# Altium project Jammer.PrjPcb
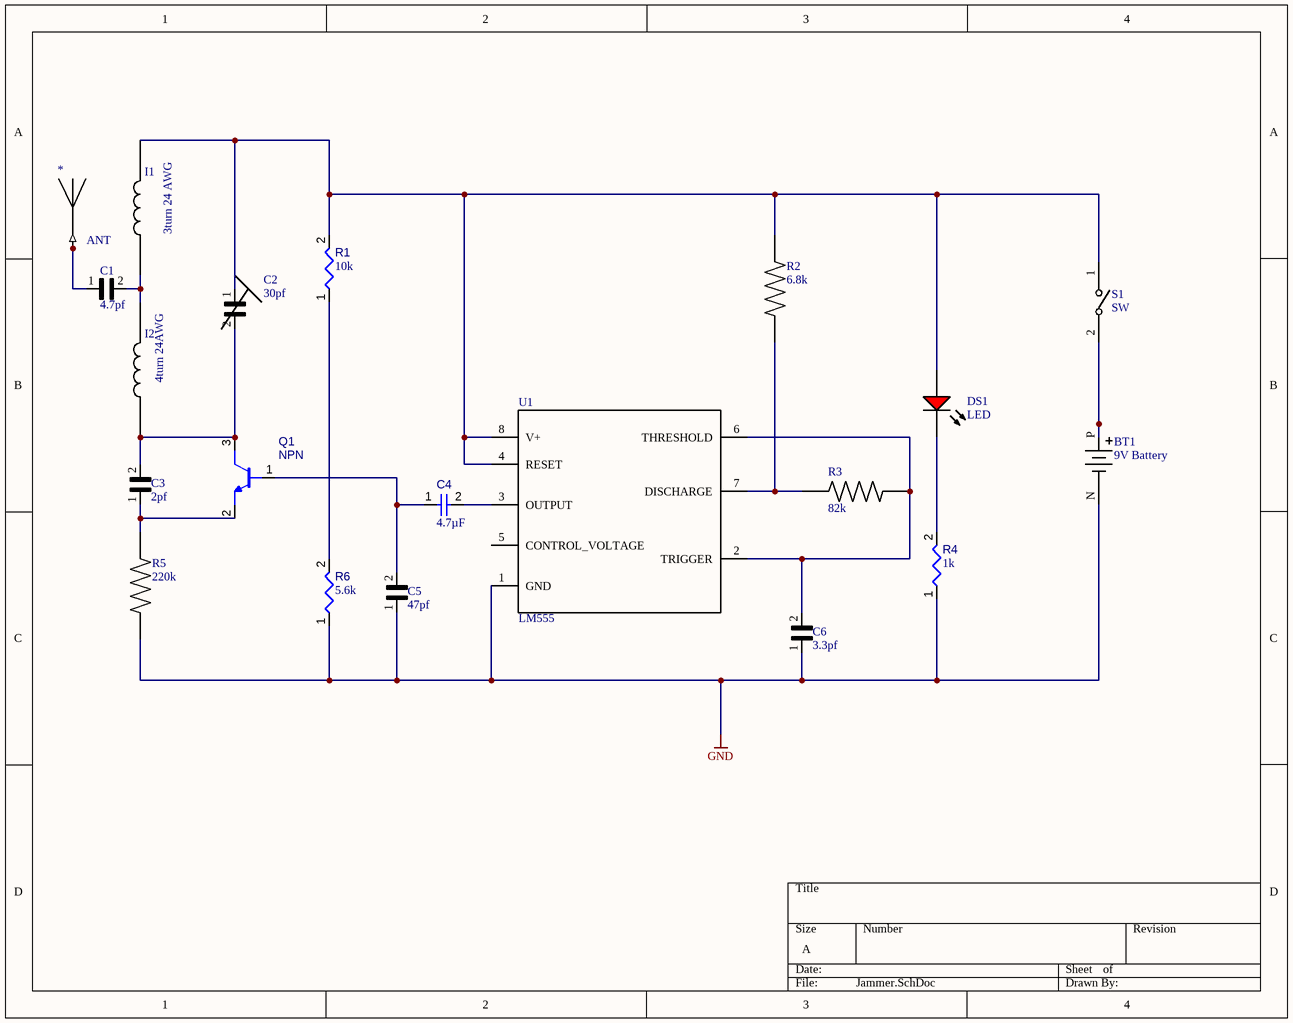
[diagram p0: Jammer.SchDoc]
1 sheet, 20 parts. Net scope: global (net labels, ports and power ports of the same name join across sheets).
Board file: Jammer.PcbDoc

## Sheet Jammer.SchDoc
size A; SheetNumber: 1; SheetTotal: 1

### Parts
*  ANT  [ANT]
BT1  9V Battery  [9V Battery]
C1  4.7pf  [4.7pf CAP]
C2  30pf  [30pf Trimmer]
C3  2pf  [2pf CAP]
C4  value 4.7µF  [CAPC0805(2012)145_L]  (hidden comment: Capacitor 4.7µF +/-40% 25V 0805)
C5  47pf  [47pf CAP]
C6  3.3pf  [3.3pf CAP]
DS1  LED  [AVAG-HSMX-C190_V]
I1  3turn 24 AWG  [Inductor]
I2  4turn 24AWG  [Inductor]
Q1  NPN  [ROHM-SOT723-3_V]
R1  value 10k  [RESC1608X55X25ML10T15]  (hidden comment: Resistor 10k +/-1% 0603 100 mW)
R2  6.8k  [6.8K RES]
R3  82k  [82K RES]
R4  value 1k  [RESC0805(2012)_L]  (hidden comment: Resistor 1K +/-5% 0805 125 mW)
R5  220k  [220 RES]
R6  value 5.6k  [RESC0402(1005)_L]  (hidden comment: 5D6KR2J)
S1  SW  [Switch]
U1  LM555  [LM555]

### Nets
GND: BT1.N(NEG) C5.1 C6.1 R4.1 R5.1 R6.1 U1.1(GND)
Net*_1: *.1(FEED) *.2(FEED) C1.1
NetBT1_P: BT1.P(POS) S1.2
NetC1_2: C1.2 I1.1 I2.2
NetC2_1: C2.1 DS1.1(A) I1.2 R1.2 R2.2 S1.1 U1.4(RESET) U1.8(V+)
NetC2_2: C2.2 C3.2 I2.1 Q1.3(C)
NetC3_1: C3.1 Q1.2(E) R5.2
NetC4_1: C4.1 C5.2 Q1.1(B)
NetC4_2: C4.2 U1.3(OUTPUT)
NetC6_2: C6.2 R3.2 U1.2(TRIGGER) U1.6(THRESHOLD)
NetDS1_2: DS1.2(K) R4.2
NetR1_1: R1.1 R6.2
NetR2_1: R2.1 R3.1 U1.7(DISCHARGE)

Not connected (* = marked no-connect by the designer): U1 5(CONTROL_VOLTAGE)

### Library data of the parts
C1 = 4.7pf CAP
C2 = 30pf Trimmer
C3 = 2pf CAP
C4 = CMP-001-00080-4: Chip Capacitor, 4.7µF +/-40%, 25V, 0805, Thickness 1.45 mm; Tolerance: 20%; Voltage Rating: 25V; Min Operating Temperature: -55°C; Max Operating Temperature: 85°C; Pins: 2; Mounting Technology: SMT; Case/Package: 0805
C5 = 47pf CAP
C6 = 3.3pf CAP
DS1 = CMP-007-00014-2: LED Uni-Color Red, 65 mW, 20 mA, -40 to 85 degC, 2-Pin SMD, RoHS, Tape and Reel; Manufacturer: Avago; Nominal Vf: 1.8V; Luminous Intensity: 17mcd; Power: 78mW; Forward Current: 20mA; Lens Style: Diffused; Viewing Angle: 170degrees; Package Quantity: 4000; Colour: Red; Manufacturer URL: http://www.avagotech.com/; Min Operating Temperature: -40°C; Datasheet URL: http://docs.avagotech.com/docs/AV02-0551EN; RoHS Compliant: True; Forward Voltage: 1.8V; Pins: 2; Max Operating Temperature: 85°C; Packaging: TapeandReel; Package Reference: HSMX-C190; Datasheet Version: Mar-12; Package Description: 2-Pin Surface Mount Device, Body 1.6 x 0.8 mm, Height 0.9 mm; Case/Package: 0603; Mounting Technology: SM; Illumination Colour: Red
I1 I2 = Inductor
Q1 = CMP-013-00028-2: NPN General Purpose Transistor, 3-Pin SOT-723, Pb-Free, Tape and Reel; ComponentLink3Description: Package Specification; ComponentLink1URL: http://www.onsemi.com/; ComponentLink3URL: http://www.onsemi.com/pub_link/Collateral/631AA.PDF; ComponentLink2Description: Datasheet; Mounting Technology: SMT; Pins: 3; Case/Package: SOT-723; RoHS Compliant: TRUE; ComponentLink1Description: Manufacturer URL; ComponentLink2URL: http://www.onsemi.cn/pub_link/Collateral/MMBT2222AM3-D.PDF
R1 = CMP-009-00017-5: Chip Resistor, 10 KOhm, +/- 1%, 01 W, -55 to 155 degC, 0603 (1608 Metric); Voltage Rating: 50V; Power: 100mW; RoHS Compliant: True; Min Operating Temperature: -55°C; Pins: 2; Case/Package: 0603; Mounting Technology: SM; Max Operating Temperature: 155°C; Tolerance: 1%
R2 = 6.8K RES
R3 = 82K RES
R4 = CMP-009-00118-3: Chip Resistor, 1 kOhms, +/-5%, 125 mW, -55 to 155 degC, 0805; Tolerance: 5%; Power: 125mW; Case/Package: 0805; Pins: 2; Min Operating Temperature: -55°C; Max Operating Temperature: 155°C
R5 = 220 RES
R6 = CMP-009-00108-2: 5K6 0.063W 5% 0402 (1005 Metric)  SMD; Power: 63mW; Tolerance: 5%; Case/Package: 0402; Mounting Technology: SMT; Pins: 2
S1 = Switch